# EAGLE design keypad (EAGLE 9.6.2)
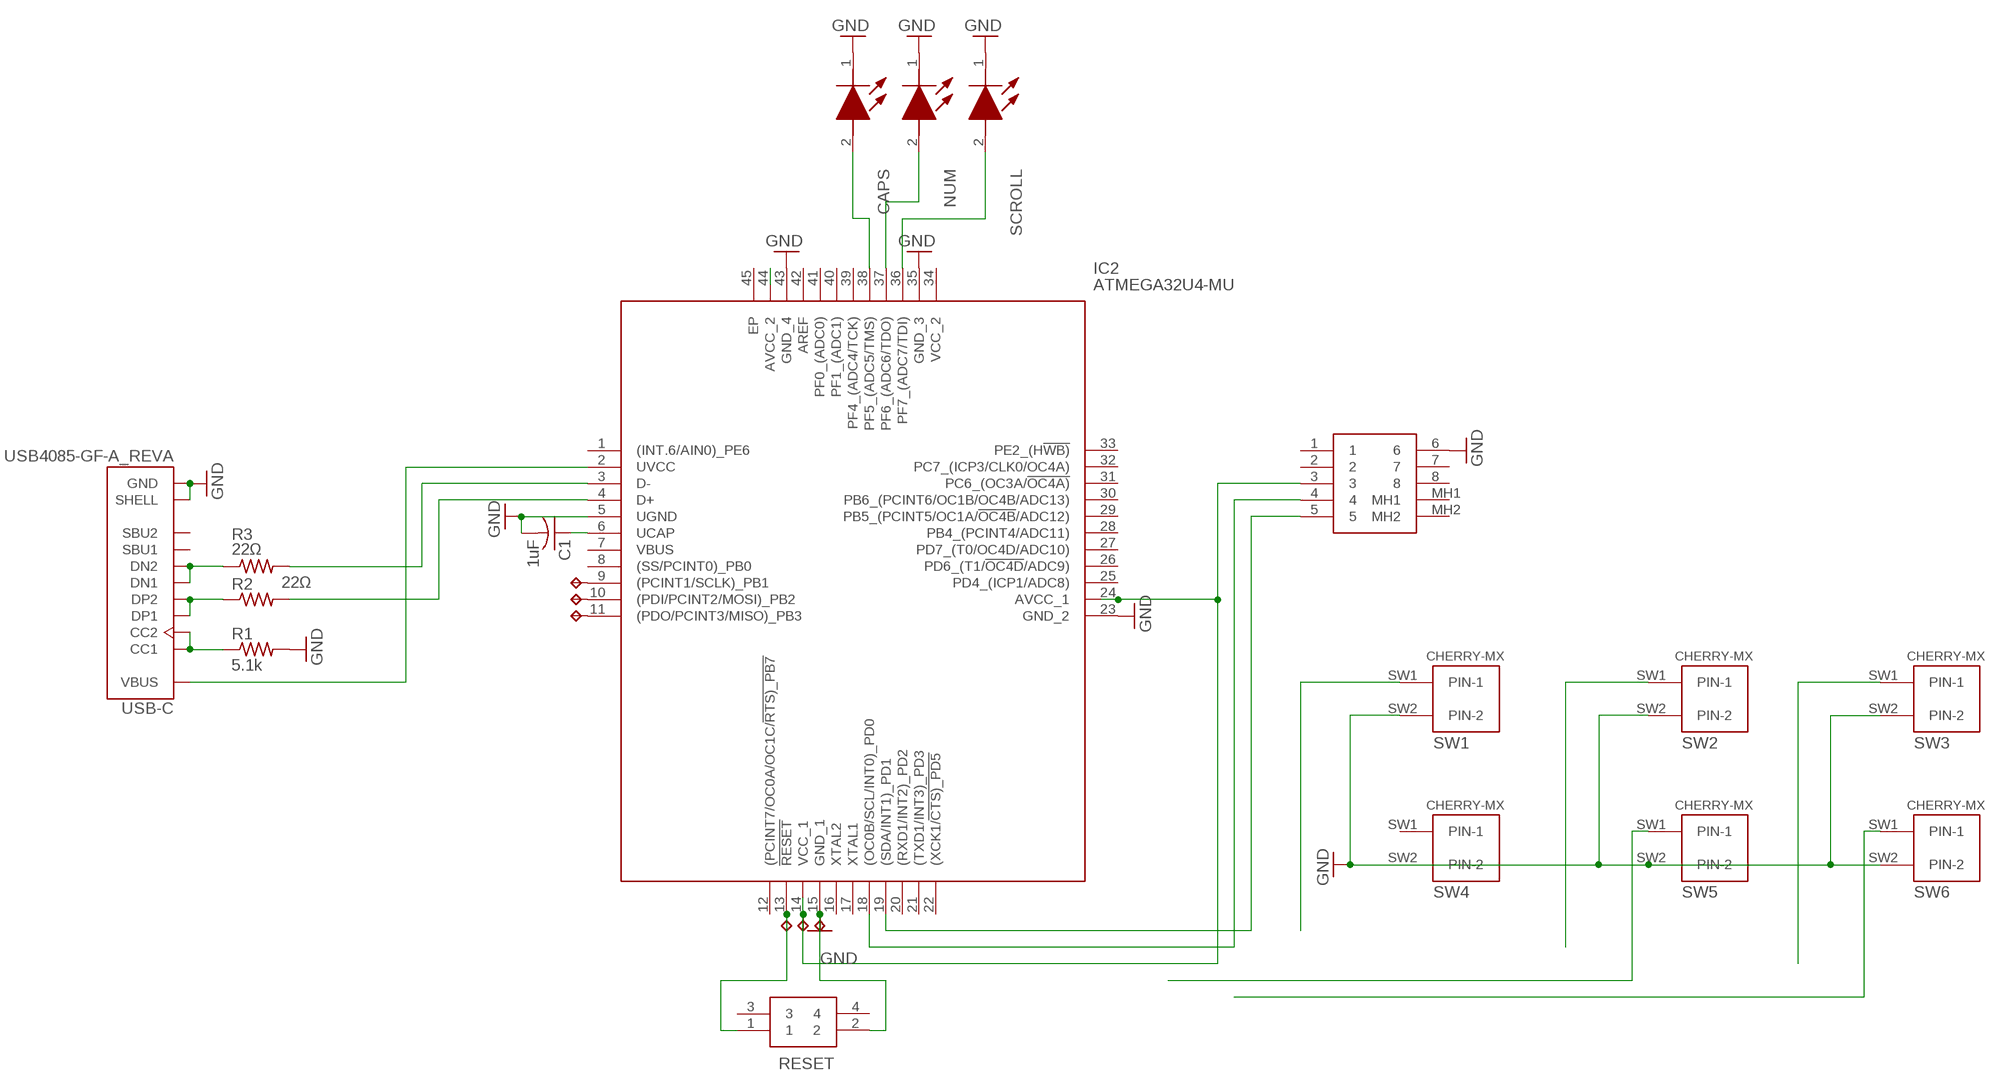
[diagram p0: schematic, sheet 1]

## Parts
5V  TPTP17R  [TP17R]
C1  1uF  C-USC0805  [C0805]
CAPS  155060GS75300  [155060GS75300]
GND  TPTP17R  [TP17R]
IC2  ATMEGA32U4-MU  [QFN50P700X700X100-45N]
J2  SS-60300-046  [SS60300046]
MISO  TPTP17R  [TP17R]
MOSI  TPTP17R  [TP17R]
NUM  155060GS75300  [155060GS75300]
R1  5.1k  R-US_R0603  [R0603]
R2  22Ω  R-US_R0805  [R0805]
R3  22Ω  R-US_R0805  [R0805]
RESET  LL3303F065QG  [LL3303F065QG]
RST  TPTP17R  [TP17R]
SCLK  TPTP17R  [TP17R]
SCROLL  155060GS75300  [155060GS75300]
SW1  CHERRY-MX  [CHERRY-MX]
SW2  CHERRY-MX  [CHERRY-MX]
SW3  CHERRY-MX  [CHERRY-MX]
SW4  CHERRY-MX  [CHERRY-MX]
SW5  CHERRY-MX  [CHERRY-MX]
SW6  CHERRY-MX  [CHERRY-MX]
USB-C  USB4085-GF-A_REVA  [GCT_USB4085-GF-A_REVA]

## Nets
CAPS: CAPS.2(A) IC2.38(PF5_(ADC5/TMS))
CC: R1.1 USB-C.A5(CC1) USB-C.B5(CC2)
CLK: IC2.19((SDA/INT1)_PD1) J2.5
D+: R2.1 USB-C.A6(DP1) USB-C.B6(DP2)
D+RES: IC2.4(D+) R2.2
D-: R3.1 USB-C.A7(DN1) USB-C.B7(DN2)
D-RES: IC2.3(D-) R3.2
DATA: IC2.18((OC0B/SCL/INT0)_PD0) J2.4
GND: C1.2 CAPS.1(K) GND.TP IC2.5(UGND) IC2.15(GND_1) IC2.23(GND_2) IC2.35(GND_3) IC2.43(GND_4) J2.6 NUM.1(K) R1.2 RESET.2 SCROLL.1(K) SW1.SW2(PIN-2) SW2.SW2(PIN-2) SW3.SW2(PIN-2) SW4.SW2(PIN-2) SW5.SW2(PIN-2) SW6.SW2(PIN-2) USB-C.A1(GND) USB-C.A12(GND) USB-C.B1(GND) USB-C.B12(GND) USB-C.P1(SHELL) USB-C.P2(SHELL) USB-C.P3(SHELL) USB-C.P4(SHELL)
MISO: IC2.11((PDO/PCINT3/MISO)_PB3) MISO.TP
MOSI: IC2.10((PDI/PCINT2/MOSI)_PB2) MOSI.TP
NUM: IC2.37(PF6_(ADC6/TDO)) NUM.2(A)
RESET: IC2.13(!RESET) RESET.1 RST.TP
SCLK: IC2.9((PCINT1/SCLK)_PB1) SCLK.TP
SCRL: IC2.36(PF7_(ADC7/TDI)) SCROLL.2(A)
SW1: SW1.SW1(PIN-1)
SW2: SW2.SW1(PIN-1)
SW3: SW3.SW1(PIN-1)
SW5: SW5.SW1(PIN-1)
SW6: SW6.SW1(PIN-1)
UCAP: C1.1 IC2.6(UCAP)
VCC: 5V.TP IC2.14(VCC_1) IC2.24(AVCC_1) IC2.44(AVCC_2) J2.3
VIN: IC2.2(UVCC) USB-C.A4(VBUS) USB-C.A9(VBUS) USB-C.B4(VBUS) USB-C.B9(VBUS)
Unconnected: IC2.1((INT.6/AIN0)_PE6) IC2.7(VBUS) IC2.8((SS/PCINT0)_PB0) IC2.12((PCINT7/OC0A/OC1C/!RTS)_PB7) IC2.16(XTAL2) IC2.17(XTAL1) IC2.20((RXD1/INT2)_PD2) IC2.21((TXD1/INT3)_PD3) IC2.22((XCK1/!CTS)_PD5) IC2.25(PD4_(ICP1/ADC8)) IC2.26(PD6_(T1/!OC4D!/ADC9)) IC2.27(PD7_(T0/OC4D/ADC10)) IC2.28(PB4_(PCINT4/ADC11)) IC2.29(PB5_(PCINT5/OC1A/!OC4B!/ADC12)) IC2.30(PB6_(PCINT6/OC1B/OC4B/ADC13)) IC2.31(PC6_(OC3A/!OC4A)) IC2.32(PC7_(ICP3/CLK0/OC4A)) IC2.33(PE2_(H!WB)) IC2.34(VCC_2) IC2.39(PF4_(ADC4/TCK)) IC2.40(PF1_(ADC1)) IC2.41(PF0_(ADC0)) IC2.42(AREF) IC2.45(EP) J2.1 J2.2 J2.7 J2.8 J2.MH1 J2.MH2 RESET.3 RESET.4 SW4.SW1(PIN-1) USB-C.A8(SBU1) USB-C.B8(SBU2)

## Library data of the parts
5V GND MISO MOSI RST SCLK = testpad:TP: Test pad
C1 = adafruit:C-US: CAPACITOR, American symbol
CAPS NUM SCROLL = SamacSys_Parts:155060GS75300: WURTH ELEKTRONIK - 155060GS75300 - LED, Green, SMD, 0603 [1608 Metric], 20 mA, 3.2 V, 525 nm Source: Datasheet; DESCRIPTION: WURTH ELEKTRONIK - 155060GS75300 - LED, Green, SMD, 0603 [1608 Metric], 20 mA, 3.2 V, 525 nm; HEIGHT: 1.18mm; MANUFACTURER_NAME: Wurth Elektronik; MANUFACTURER_PART_NUMBER: 155060GS75300; MOUSER_PART_NUMBER: 710-155060GS75300; MOUSER_PRICE-STOCK: https://www.mouser.co.uk/ProductDetail/Wurth-Elektronik/155060GS75300/?qs=GedFDFLaBXH9gWG%252BJzMHAg%3D%3D
IC2 = SamacSys_Parts:ATMEGA32U4-MU: MCU 8-bit ATmega AVR RISC 32KB Flash Atmel ATMEGA32U4-MU, 8bit AVR Microcontroller, 16MHz, 32 kB Flash, 44-Pin QFN Source: Datasheet <https://componentsearchengine.com/Datasheets/2/ATMEGA32U4-MU.pdf>; DESCRIPTION: MCU 8-bit ATmega AVR RISC 32KB Flash Atmel ATMEGA32U4-MU, 8bit AVR Microcontroller, 16MHz, 32 kB Flash, 44-Pin QFN; HEIGHT: 1mm; MANUFACTURER_NAME: Microchip; MANUFACTURER_PART_NUMBER: ATMEGA32U4-MU; MOUSER_PART_NUMBER: 556-ATMEGA32U4-MU; MOUSER_PRICE-STOCK: https://www.mouser.co.uk/ProductDetail/Microchip-Technology-Atmel/ATMEGA32U4-MU?qs=JV7lzlMm3yJYRpi0cY3cKw%3D%3D
J2 = SamacSys_Parts:SS-60300-046: Ethernet Connectors R ANG SHIELDED JACK ;SS60300046 Source: Datasheet <https://www.mouser.de/datasheet/2/643/dr-STW-SS-60300-046-1596894.pdf>; DESCRIPTION: Ethernet Connectors R ANG SHIELDED JACK ;SS60300046; HEIGHT: 14.33mm; MANUFACTURER_NAME: Bel; MANUFACTURER_PART_NUMBER: SS-60300-046; MOUSER_PART_NUMBER: 530-SS-60300-046
R1-R3 = adafruit:R-US_: RESISTOR, American symbol
RESET = SamacSys_Parts:LL3303F065QG: Pushbutton Switches 50mA 12VDC F065 7.0mm Gull Wing Source: Datasheet <http://spec_sheets.e-switch.com/specs/P090008.pdf>; DESCRIPTION: Pushbutton Switches 50mA 12VDC F065 7.0mm Gull Wing; HEIGHT: 3.4mm; MANUFACTURER_NAME: E-Switch; MANUFACTURER_PART_NUMBER: LL3303F065QG; MOUSER_PART_NUMBER: 612-LL3303F065QG; MOUSER_PRICE-STOCK: https://www.mouser.co.uk/ProductDetail/E-Switch/LL3303F065QG?qs=QtyuwXswaQjocAyEnLyPSg%3D%3D
SW1-SW6 = cherrymx:CHERRY-MX: Cherry MX series keyswitch
USB-C = USB4085-GF-A_REVA:USB4085-GF-A_REVA: USB 2.0 Type C Receptacle Dip Type, PCB Top Mount Check prices <https://pricing.snapeda.com/parts/USB4085-GF-A/Global%20Connector%20Technology/view-part?ref=eda>; AVAILABILITY: Warning; DESCRIPTION: USB-C (USB TYPE-C) USB 2.0 Receptacle Connector 24 (16+8 Dummy) Position Through Hole, Right Angle; MF: Global Connector Technology; MP: USB4085-GF-A; PACKAGE: Package; PRICE: None; PURCHASE-URL: https://pricing.snapeda.com/search/part/USB4085-GF-A/?ref=eda

## Board
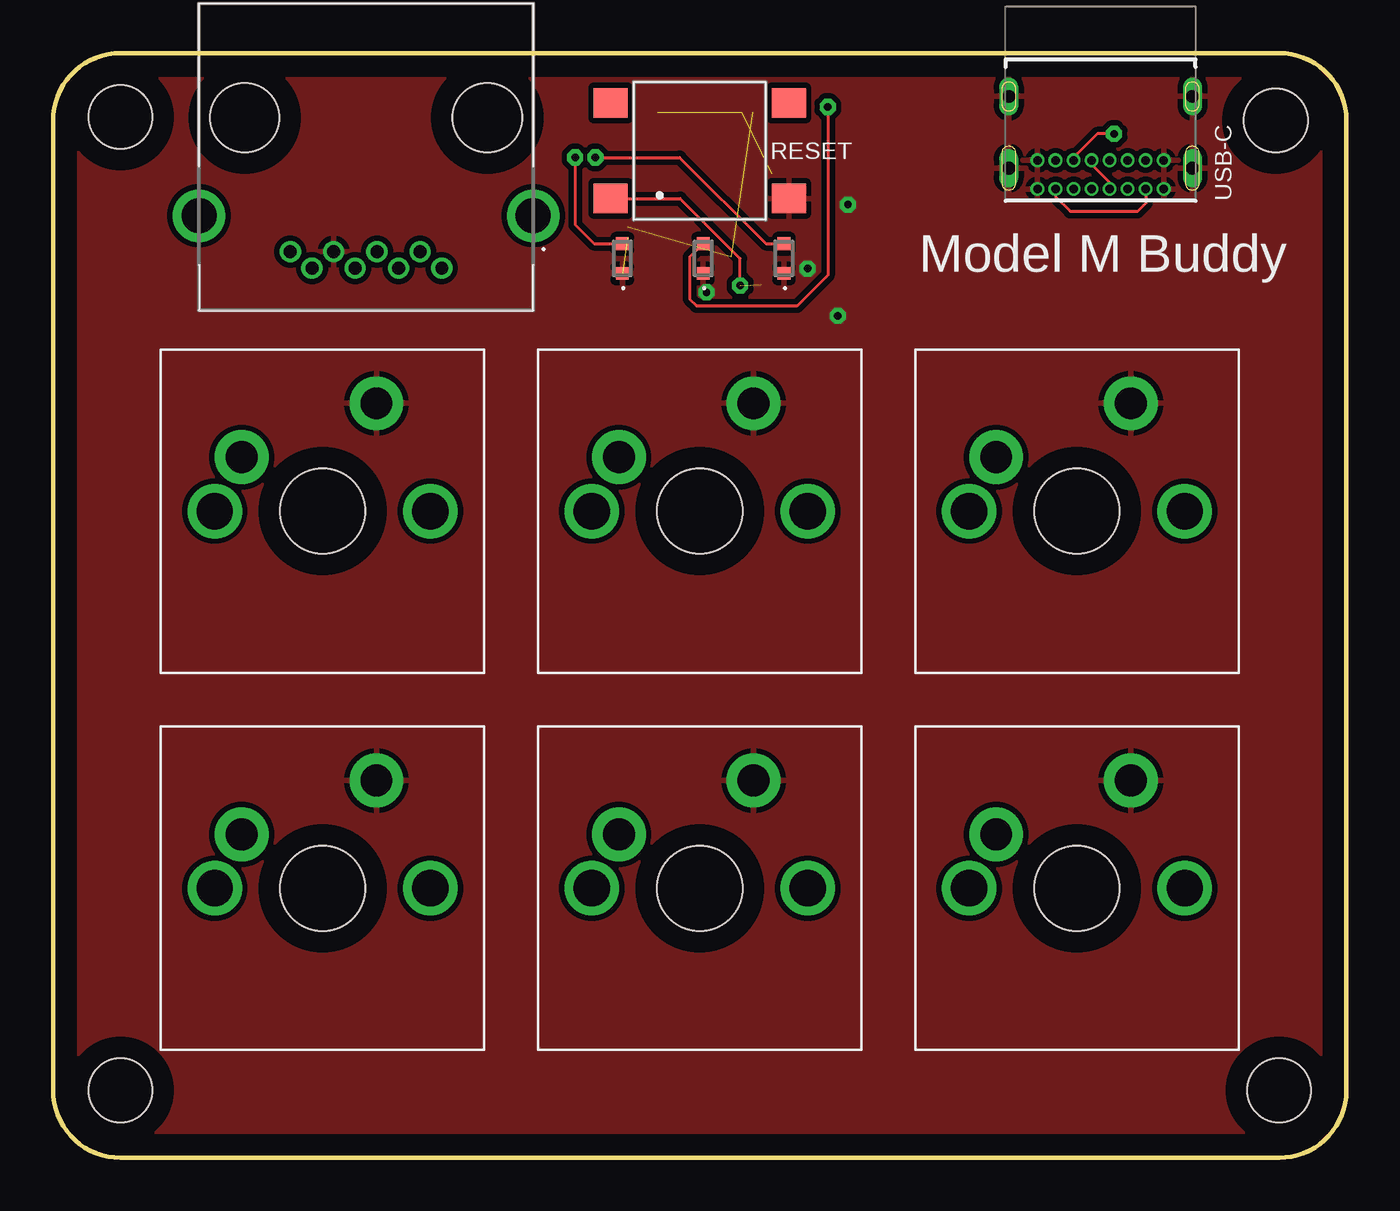
[diagram p1: board, top side]
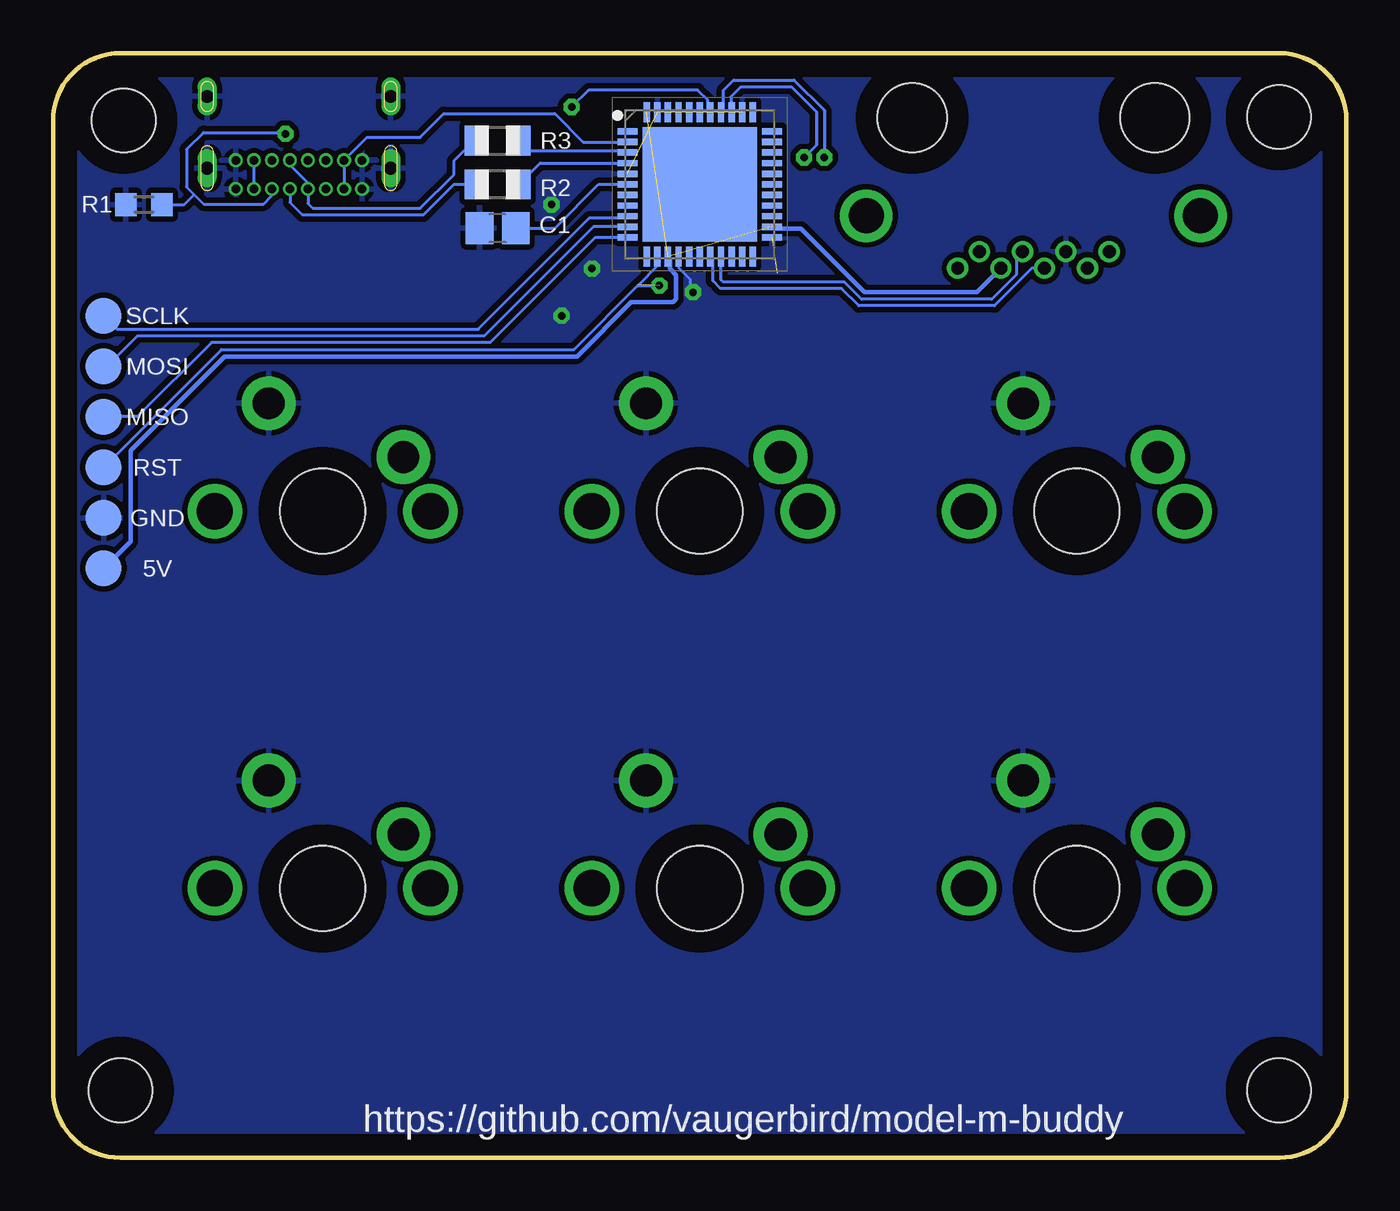
[diagram p2: board, bottom side, seen from below]

Size 60.96 x 52.07 mm. Coordinates in mm from the lower left corner, seen from the top.
Outline: 3.18,0 57.79,0 arc90 60.96,3.17 60.96,48.9 arc90 57.79,52.07 3.18,52.07 arc90 0,48.9 0,3.17 arc90 3.18,0
Copper layers (1*16): Top 0.035mm / dielectric 1.5mm / Bottom 0.035mm
Design rules "default *": minimum track width 6mil, minimum drill 0.35mm, track to track 6mil, track to pad 6mil, pad to pad 6mil, via to via 6mil, smd to smd 6mil, copper to edge 40mil, drill to drill 6mil, minimum pad ring 4mil, minimum via ring 8mil, stop-mask expansion 4mil, vias tented up to drill 0mil, thermal gap 10mil
Holes 3 mm at 57.79,3.17 57.63,48.9 3.18,3.17 3.18,49.05

### Footprints (pad centres in the part's own frame; a part is rotated, then mirrored left to right if it is on the bottom)
TP17R = smd 1.7 x 1.7: TP 0,0
C0805 = smd 1.3 x 1.5: 1 -0.85,0; 2 0.85,0
155060GS75300 = smd 0.6 x 0.6: 1 -0.7,0; 2 0.7,0
QFN50P700X700X100-45N = smd 0.95 x 0.3: 1 -3.4,2.5; 2 -3.4,2; 3 -3.4,1.5; 4 -3.4,1; 5 -3.4,0.5; 6 -3.4,0; 7 -3.4,-0.5; 8 -3.4,-1; 9 -3.4,-1.5; 10 -3.4,-2; 11 -3.4,-2.5; 23 3.4,-2.5; 24 3.4,-2; 25 3.4,-1.5; 26 3.4,-1; 27 3.4,-0.5; 28 3.4,0; 29 3.4,0.5; 30 3.4,1; 31 3.4,1.5; 32 3.4,2; 33 3.4,2.5 | smd 0.3 x 0.95: 12 -2.5,-3.4; 13 -2,-3.4; 14 -1.5,-3.4; 15 -1,-3.4; 16 -0.5,-3.4; 17 0,-3.4; 18 0.5,-3.4; 19 1,-3.4; 20 1.5,-3.4; 21 2,-3.4; 22 2.5,-3.4; 34 2.5,3.4; 35 2,3.4; 36 1.5,3.4; 37 1,3.4; 38 0.5,3.4; 39 0,3.4; 40 -0.5,3.4; 41 -1,3.4; 42 -1.5,3.4; 43 -2,3.4; 44 -2.5,3.4 | smd 5.4 x 5.4: 45 0,0
SS60300046 = drill 0.61 pad 1: 1 0,0; 2 1.02,-0.77; 3 -1.02,-0.77; 4 -3.06,-0.77; 5 -2.04,0; 6 -4.08,0; 7 -6.12,0; 8 -5.1,-0.77 | drill 1.65 pad 2.475: MH1 -10.425,1.7; MH2 5.325,1.7 | hole 3.25: 3.165,6.32; -8.265,6.32
R0603 = smd 1 x 1.1: 1 -0.85,0; 2 0.85,0
R0805 = smd 1.1 x 1.4: 1 -1,0; 2 1,0
LL3303F065QG = smd 1.6 x 1.4: 1 -4.2,-2.25; 2 4.2,-2.25; 3 -4.2,2.25; 4 4.2,2.25
CHERRY-MX = drill 1.714 pad 1.93: P$3 -5.08,0; P$4 5.08,0 | drill 1.5 pad 2.54: SW1 -3.81,2.54; SW2 2.54,5.08 | hole 4: 0,0
GCT_USB4085-GF-A_REVA = drill 0.4 pad 0.65: A1 -2.975,4.025; A4 -2.125,4.025; A5 -1.275,4.025; A6 -0.425,4.025; A7 0.425,4.025; A8 1.275,4.025; A9 2.125,4.025; A12 2.975,4.025; B1 2.975,2.675; B4 2.125,2.675; B5 1.275,2.675; B6 0.425,2.675; B7 -0.425,2.675; B8 -1.275,2.675; B9 -2.125,2.675; B12 -2.975,2.675 | drill 0.6 long: P1 -4.325,3.045; P2 4.325,3.045; P3 4.325,-0.335; P4 -4.325,-0.335

### Placement (x,y rotation side)
5V  58.58,27.78 0 bottom
C1  40.01,43.82 180 bottom
CAPS  30.64,42.39 90 top
GND  58.58,30.16 0 bottom
IC2  30.48,45.88 0 bottom
J2  17.3,42.7 0 top
MISO  58.58,34.93 0 bottom
MOSI  58.58,37.31 0 bottom
NUM  26.83,42.39 90 top
R1  56.67,44.93 180 bottom
R2  40.01,45.88 0 bottom
R3  40.01,47.94 0 bottom
RESET  30.48,47.47 0 top
RST  58.58,32.54 0 bottom
SCLK  58.58,39.69 0 bottom
SCROLL  34.45,42.39 90 top
SW1  12.7,30.48 0 top
SW2  30.48,30.48 0 top
SW3  48.26,30.48 0 top
SW4  12.7,12.7 0 top
SW5  30.48,12.7 0 top
SW6  48.26,12.7 0 top
USB-C  49.37,49.69 180 top

### Tracks (layer width: path | path; a pad name or v marks a point on that pad's centre or on a via)
CAPS  (via drill 0.35)
  Top 0.152: v36.51,49.53 36.51,41.59 35.08,40.16 30.32,40.16 30,40.48 30,42.45 CAPS.2
  Bottom 0.152: IC2.38 30.1,49.4 30.1,49.85 30.58,50.32 35.72,50.32 v36.51,49.53
CC  (via drill 0.35)
  Top 0.152: v50.01,48.26 49.21,48.26 48.1,47.14 USB-C.B5
  Bottom 0.152: USB-C.A5 50.65,45.35 51.04,44.96 53.86,44.96 54.3,45.39 | v50.01,48.26 50.01,48.32 53.87,48.32 54.66,47.53 54.66,45.76 54.3,45.39 | R1.1 54.77,44.93 54.3,45.39
CLK
  Bottom 0.152: J2.5 15.55,42.41 15.55,41.63 16.72,40.47 22.86,40.47 23.66,41.27 29.37,41.27 29.48,41.39 IC2.19
D+
  Top 0.152: USB-C.B6 48.95,46.83 | 48.95,46.83 48.95,46.78 | 49.8,45.94 USB-C.A6 49.8,45.98 48.95,46.83
  Bottom 0.152: USB-C.A6 49.8,45.03 49.22,44.45 43.5,44.45 42.07,45.88 R2.1
D+RES
  Bottom 0.152: R2.2 38.01,46.88 IC2.4
D-
  Bottom 0.152: USB-C.B7 49.8,46.78 48.95,45.93 USB-C.A7 | USB-C.A7 48.95,45.94 | USB-C.A7 48.95,44.98 48.72,44.76 43.66,44.76 42.07,46.34 42.07,46.99 41.12,47.94 R3.1
D-RES
  Bottom 0.152: 38.77,48.17 R3.2 38.53,47.47 33.97,47.47 IC2.3
DATA
  Bottom 0.152: IC2.18 29.86,42.36 29.86,41.33 29.49,40.97 23.79,40.97 22.98,40.16 16.59,40.16 14.82,41.93 J2.4
GND  (via drill 0.35)  (3 unrouted)
  Bottom 0.152: IC2.15 31.48,41.96 30.94,41.43 30.94,40.95 v30.8,40.8
  other vias: 36.99,39.69 35.56,41.91 37.46,44.93
  pour Top (isolate 0.254): 0,0 0,52.07 60.96,52.07 60.96,0
  pour Bottom (isolate 0.254): 0,52.07 0,0 60.96,0 60.96,52.07
MISO
  Bottom 0.152: 58.42,34.77 MISO.TP 56.99,34.93 53.49,38.43 40.35,38.43 35.41,43.38 IC2.11
MOSI
  Bottom 0.152: MOSI.TP 58.5,37.23 56.99,38.73 40.64,38.73 35.5,43.88 IC2.10
NUM  (via drill 0.35)
  Top 0.152: v24.61,47.15 24.61,43.97 25.49,43.09 NUM.2
  Bottom 0.152: IC2.37 29.36,49.4 29.36,50.32 28.88,50.8 26.04,50.8 24.61,49.37 v24.61,47.15
RESET  (via drill 0.35)  (1 unrouted)
  Top 0.152: 26.28,44.74 RESET.1 29.55,45.22 32.38,42.39 v32.38,41.12
  Bottom 0.152: IC2.13 32.42,42.42 32.44,42.39 32.44,42.07 33.39,41.12 v32.38,41.12 | 58.26,32.86 RST.TP 53.02,38.1 36.41,38.1 33.37,41.15
SCLK
  Bottom 0.152: 33.95,44.45 IC2.9 33.98,44.28 35.7,44.28 40.93,39.05 57.94,39.05 SCLK.TP
SCRL  (via drill 0.35)
  Top 0.152: v25.56,47.15 29.53,47.15 33.59,43.09 SCROLL.2
  Bottom 0.152: IC2.36 29.02,49.32 29.02,50.01 28.54,50.48 26.15,50.48 24.98,49.31 24.98,47.73 v25.56,47.15
UCAP
  Bottom 0.152: C1.1 37.31,43.82 35.24,45.88 IC2.6
VCC  (2 unrouted)
  Bottom 0.203: IC2.24 26.98,43.78 25.71,43.78 22.72,40.8 17.42,40.8 J2.3 | 5V.TP 57.31,29.05 57.31,33.34 52.88,37.77 36.27,37.77 33.72,40.32 31.75,40.32 31.59,40.48 31.59,41.61 31.88,41.9 31.88,42.38 IC2.14
VIN
  Top 0.152: USB-C.A4 51.5,44.99 51.12,44.61 47.94,44.61 47.25,45.3 USB-C.A9
  Bottom 0.152: USB-C.A9 USB-C.B4 46.16,48.1 43.66,48.1 42.54,49.21 37.31,49.21 35.97,47.88 IC2.2 | USB-C.B9 USB-C.A4

### Text on the board
tNames: Model M Buddy
bNames: https://github.com/vaugerbird/model-m-buddy